# Altium schematic sheet fpga-bank7.SchDoc: CS - FPGA - Bank 7
size Letter; CheckedBy: J. Brinton; CompanyName: Signal Laboratories, Inc.; DrawnBy: J. Brinton; Engineer: J. Brinton; Address1: 3479 Edison Way; Address2: Menlo Park CA 94025; Address3: +1 (877) 778-8435; Address4: siglabs.com; Revision: 3; SheetNumber: 11; SheetTotal: 47
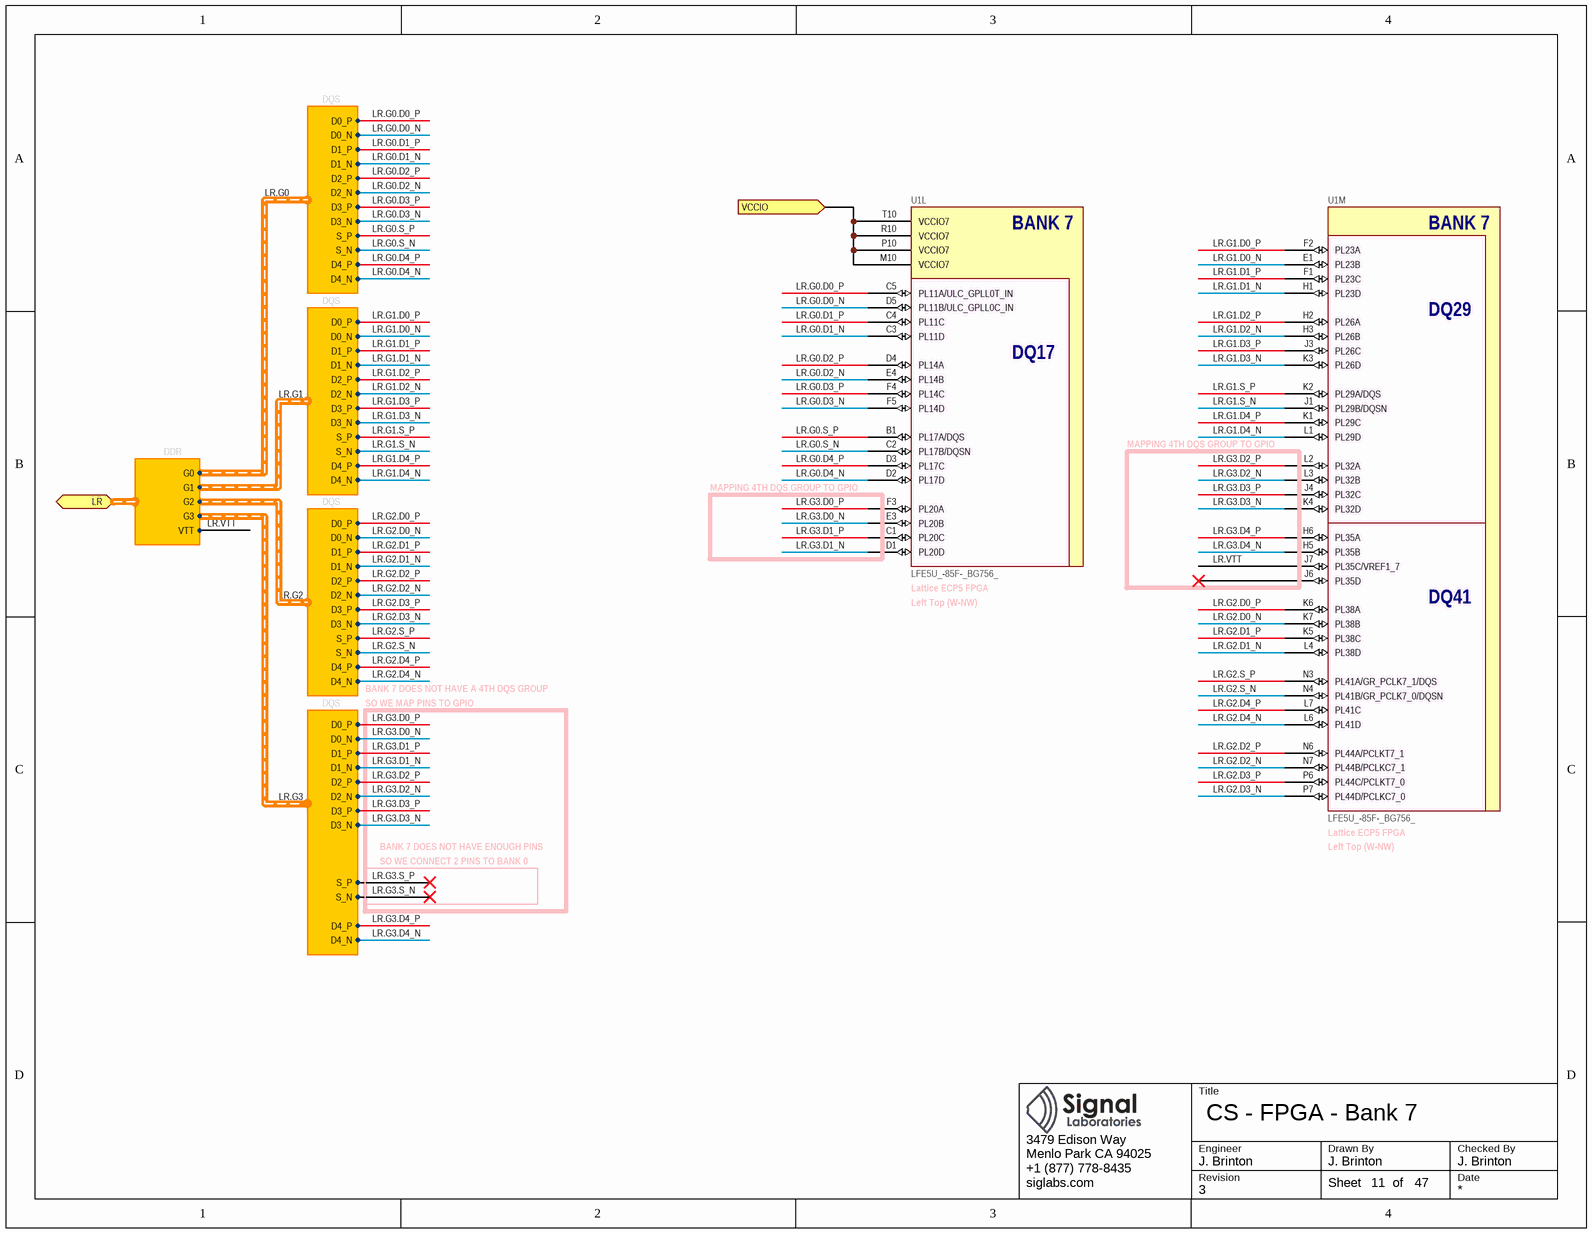
[diagram p0: fpga-bank7.SchDoc]

## Parts
U1  LFE5U_-85F-_BG756_  [caBGA756]  (parts L,M of 19)

## Ports
LR (harness DDR), VCCIO (in)

## Harnesses
DQS: D0_P, D0_N, D1_P, D1_N, D2_P, D2_N, D3_P, D3_N, D4_P, D4_N, S_P, S_N
DDR: G0, G1, G2, G3, VTT

## Nets
LR.G0.D0_N: U1.D5(PL11B/ULC_GPLL0C_IN) ; harness DQS.D0_N
LR.G0.D0_P: U1.C5(PL11A/ULC_GPLL0T_IN) ; harness DQS.D0_P
LR.G0.D1_N: U1.C3(PL11D) ; harness DQS.D1_N
LR.G0.D1_P: U1.C4(PL11C) ; harness DQS.D1_P
LR.G0.D2_N: U1.E4(PL14B) ; harness DQS.D2_N
LR.G0.D2_P: U1.D4(PL14A) ; harness DQS.D2_P
LR.G0.D3_N: U1.F5(PL14D) ; harness DQS.D3_N
LR.G0.D3_P: U1.F4(PL14C) ; harness DQS.D3_P
LR.G0.D4_N: U1.D2(PL17D) ; harness DQS.D4_N
LR.G0.D4_P: U1.D3(PL17C) ; harness DQS.D4_P
LR.G0.S_N: U1.C2(PL17B/DQSN) ; harness DQS.S_N
LR.G0.S_P: U1.B1(PL17A/DQS) ; harness DQS.S_P
LR.G1.D0_N: U1.E1(PL23B) ; harness DQS.D0_N
LR.G1.D0_P: U1.F2(PL23A) ; harness DQS.D0_P
LR.G1.D1_N: U1.H1(PL23D) ; harness DQS.D1_N
LR.G1.D1_P: U1.F1(PL23C) ; harness DQS.D1_P
LR.G1.D2_N: U1.H3(PL26B) ; harness DQS.D2_N
LR.G1.D2_P: U1.H2(PL26A) ; harness DQS.D2_P
LR.G1.D3_N: U1.K3(PL26D) ; harness DQS.D3_N
LR.G1.D3_P: U1.J3(PL26C) ; harness DQS.D3_P
LR.G1.D4_N: U1.L1(PL29D) ; harness DQS.D4_N
LR.G1.D4_P: U1.K1(PL29C) ; harness DQS.D4_P
LR.G1.S_N: U1.J1(PL29B/DQSN) ; harness DQS.S_N
LR.G1.S_P: U1.K2(PL29A/DQS) ; harness DQS.S_P
LR.G2.D0_N: U1.K7(PL38B) ; harness DQS.D0_N
LR.G2.D0_P: U1.K6(PL38A) ; harness DQS.D0_P
LR.G2.D1_N: U1.L4(PL38D) ; harness DQS.D1_N
LR.G2.D1_P: U1.K5(PL38C) ; harness DQS.D1_P
LR.G2.D2_N: U1.N7(PL44B/PCLKC7_1) ; harness DQS.D2_N
LR.G2.D2_P: U1.N6(PL44A/PCLKT7_1) ; harness DQS.D2_P
LR.G2.D3_N: U1.P7(PL44D/PCLKC7_0) ; harness DQS.D3_N
LR.G2.D3_P: U1.P6(PL44C/PCLKT7_0) ; harness DQS.D3_P
LR.G2.D4_N: U1.L6(PL41D) ; harness DQS.D4_N
LR.G2.D4_P: U1.L7(PL41C) ; harness DQS.D4_P
LR.G2.S_N: U1.N4(PL41B/GR_PCLK7_0/DQSN) ; harness DQS.S_N
LR.G2.S_P: U1.N3(PL41A/GR_PCLK7_1/DQS) ; harness DQS.S_P
LR.G3.D0_N: U1.E3(PL20B) ; harness DQS.D0_N
LR.G3.D0_P: U1.F3(PL20A) ; harness DQS.D0_P
LR.G3.D1_N: U1.D1(PL20D) ; harness DQS.D1_N
LR.G3.D1_P: U1.C1(PL20C) ; harness DQS.D1_P
LR.G3.D2_N: U1.L3(PL32B) ; harness DQS.D2_N
LR.G3.D2_P: U1.L2(PL32A) ; harness DQS.D2_P
LR.G3.D3_N: U1.K4(PL32D) ; harness DQS.D3_N
LR.G3.D3_P: U1.J4(PL32C) ; harness DQS.D3_P
LR.G3.D4_N: U1.H5(PL35B) ; harness DQS.D4_N
LR.G3.D4_P: U1.H6(PL35A) ; harness DQS.D4_P
LR.G3.S_N: harness DQS.S_N
LR.G3.S_P: harness DQS.S_P
LR.VTT: U1.J7(PL35C/VREF1_7) ; port LR.VTT
VCCIO: U1.M10(VCCIO7) U1.P10(VCCIO7) U1.R10(VCCIO7) U1.T10(VCCIO7) ; port VCCIO

Not connected (* = marked no-connect by the designer): U1 J6(PL35D)*

## Notes on the sheet
- (near U1) MAPPING 4TH DQS GROUP TO GPIO
- (near U1) Left Top (W-NW)
- (near U1) Lattice ECP5 FPGA
- BANK 7 DOES NOT HAVE A 4TH DQS GROUP
- SO WE MAP PINS TO GPIO
- BANK 7 DOES NOT HAVE ENOUGH PINS
- SO WE CONNECT 2 PINS TO BANK 0
- Title
- Engineer
- Revision
- Drawn By
- Checked By
- Date
- Sheet
- of
- (in symbol LFE5U_-85F-_BG756_, part L) BANK 7; DQ17
- (in symbol LFE5U_-85F-_BG756_, part M) BANK 7; DQ29; DQ41

## Library data of the parts
U1 = LFE5U_-85F-_BG756_: ECP5 FPGA, 85k LUT, 756-caBGA; Manufacturer: Lattice Semiconductor; Manufacturer P/N: LFE5U_-85F-_BG756_